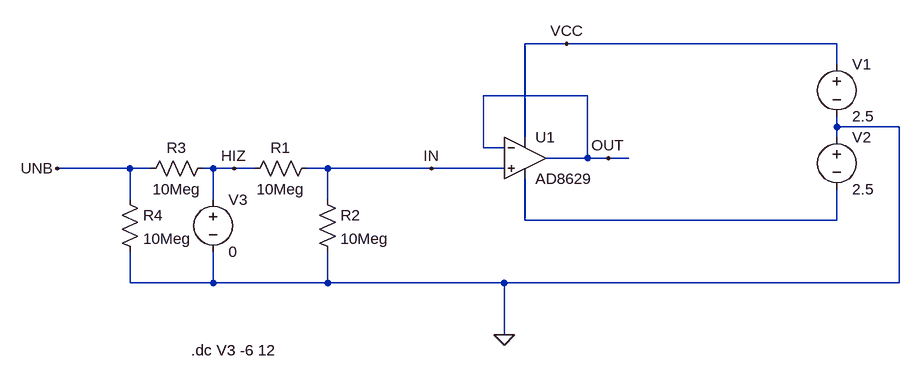
[diagram p0: schematic Electrometer_Input_DMM.asc]
Electrometer_Input_DMM.asc, the LTspice schematic file:
Version 4
SHEET 1 880 680
WIRE 240 -16 176 -16
WIRE 656 -16 240 -16
WIRE 656 16 656 -16
WIRE 272 64 112 64
WIRE 656 112 656 96
WIRE 752 112 656 112
WIRE 176 128 176 -16
WIRE 656 128 656 112
WIRE 112 144 112 64
WIRE 144 144 112 144
WIRE 272 160 272 64
WIRE 272 160 208 160
WIRE 304 160 272 160
WIRE 336 160 304 160
WIRE -432 176 -544 176
WIRE -400 176 -432 176
WIRE -304 176 -320 176
WIRE -272 176 -304 176
WIRE -240 176 -272 176
WIRE -128 176 -160 176
WIRE 32 176 -128 176
WIRE 144 176 32 176
WIRE -432 224 -432 176
WIRE -304 224 -304 176
WIRE -128 224 -128 176
WIRE 176 256 176 192
WIRE 656 256 656 208
WIRE 656 256 176 256
WIRE -432 352 -432 304
WIRE -304 352 -304 304
WIRE -304 352 -432 352
WIRE -128 352 -128 304
WIRE -128 352 -304 352
WIRE 144 352 -128 352
WIRE 752 352 752 112
WIRE 752 352 144 352
WIRE 144 432 144 352
FLAG 144 432 0
FLAG -272 176 HIZ
FLAG 32 176 IN
FLAG 304 160 OUT
FLAG 240 -16 VCC
FLAG -544 176 UNB
SYMBOL Opamps\\AD8629 176 96 R0
SYMATTR InstName U1
SYMBOL voltage 656 0 R0
SYMATTR InstName V1
SYMATTR Value 2.5
SYMBOL voltage 656 112 R0
SYMATTR InstName V2
SYMATTR Value 2.5
SYMBOL voltage -304 208 R0
SYMATTR InstName V3
SYMATTR Value 0
SYMBOL res -144 160 R90
WINDOW 0 0 56 VBottom 2
WINDOW 3 32 56 VTop 2
SYMATTR InstName R1
SYMATTR Value 10Meg
SYMBOL res -144 208 R0
SYMATTR InstName R2
SYMATTR Value 10Meg
SYMBOL res -304 160 R90
WINDOW 0 0 56 VBottom 2
WINDOW 3 32 56 VTop 2
SYMATTR InstName R3
SYMATTR Value 10Meg
SYMBOL res -448 208 R0
SYMATTR InstName R4
SYMATTR Value 10Meg
TEXT -338 456 Left 2 !.dc V3 -6 12

The netlist it stands for:
* Electrometer_Input_DMM.asc
XU1 IN OUT VCC N001 OUT AD8629  ; pins In+ In- V+ V- OUT
V1 VCC 0 2.5
V2 0 N001 2.5
V3 HIZ 0 0
R1 IN HIZ 10Meg
R2 IN 0 10Meg
R3 HIZ UNB 10Meg
R4 UNB 0 10Meg
.dc V3 -6 12
.backanno
.end